# EAGLE schematic Pulsar v1 (EAGLE 5.11)

## Sheet 1 of 6
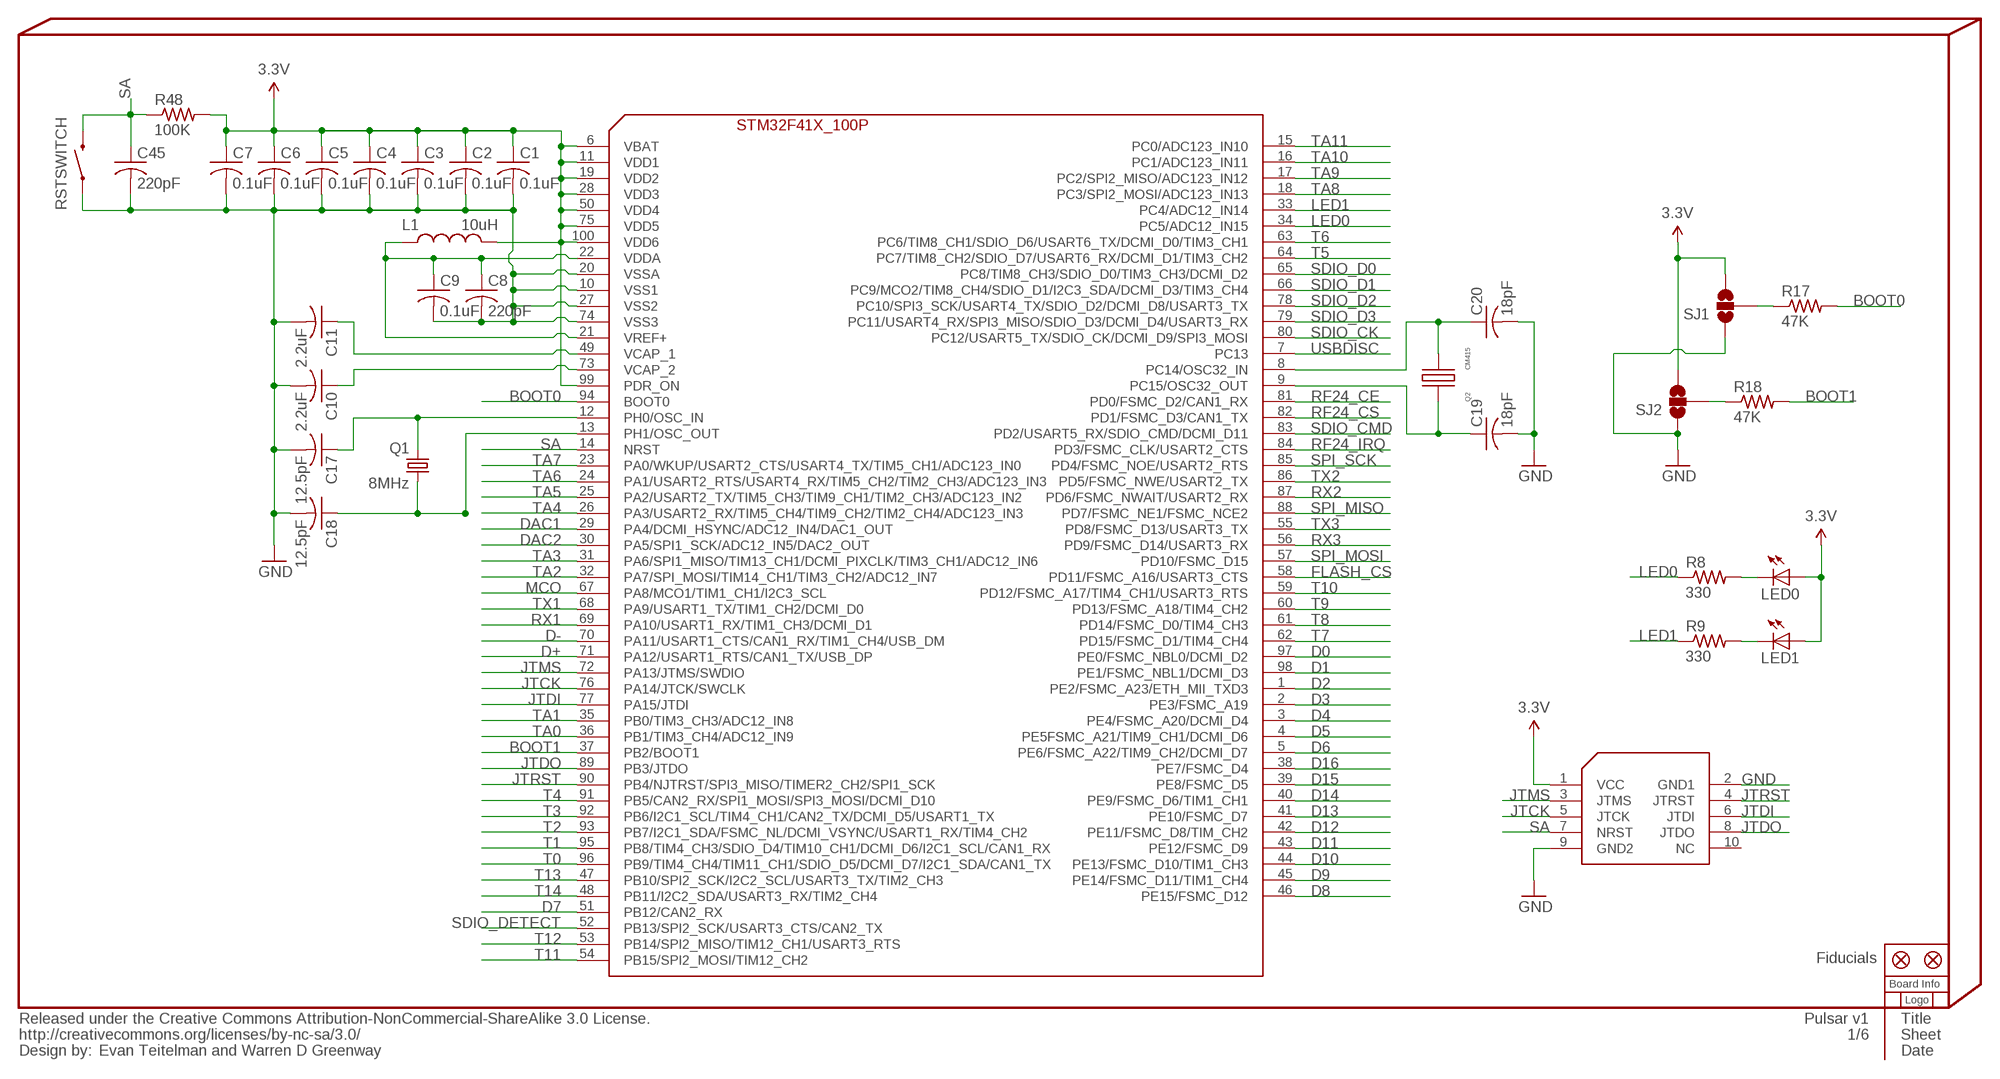
[diagram p0: schematic, sheet 1]

### Parts
C1  0.1uF  C-USC0402  [C0402]
C2  0.1uF  C-USC0402  [C0402]
C3  0.1uF  C-USC0402  [C0402]
C4  0.1uF  C-USC0402  [C0402]
C5  0.1uF  C-USC0402  [C0402]
C6  0.1uF  C-USC0402  [C0402]
C7  0.1uF  C-USC0402  [C0402]
C8  220pF  C-USC0402  [C0402]
C9  0.1uF  C-USC0402  [C0402]
C10  2.2uF  C-USC0402  [C0402]
C11  2.2uF  C-USC0402  [C0402]
C17  12.5pF  C-USC0402  [C0402]
C18  12.5pF  C-USC0402  [C0402]
C19  18pF  C-USC0402  [C0402]
C20  18pF  C-USC0402  [C0402]
C45  220pF  C-USC0402  [C0402]
INFO12  Evan Teitelman and Warren D Greenway  %CC-NC-SA  [%CC-NC-SA]
INFO13  %BRDINFOPULSAR  [%BOARDINFO-PULSAR]
JP1  FIDUCIAL1X2  [FIDUCIAL-1X2]
JP2  FIDUCIAL1X2  [FIDUCIAL-1X2]
L1  10uH  INDUCTOR0805  [0805]
LED0  LED0603  [LED-0603]
LED1  LED0603  [LED-0603]
LOGO1  Designed by Evan Teitelman and Warren D Greenway  #LOGOA+LONGTEXT  [#LOGOA+LONGTEXT]
Q1  8MHz  CRYSTAL5X3  [CRYSTAL-SMD-5X3]
Q2  CM415  [CM415]
R8  330  R-US_R0402  [R0402]
R9  330  R-US_R0402  [R0402]
R17  47K  R-US_R0402  [R0402]
R18  47K  R-US_R0402  [R0402]
R48  100K  R-US_R0402  [R0402]
RSTSWITCH  SWITCH-MOMENTARY-2SMD  [TACTILE_SWITCH_SMD]
SJ1  SOLDERJUMPER_2WAYS  [SJ_3]
SJ2  SOLDERJUMPER_2WAYS  [SJ_3]
U5  STM32-JTAG-10P  [STM32-JTAG-10P]
U$1  STM32F41X-100P  [TQFP100]

### Nets
3.3V: C1.1 C2.1 C3.1 C4.1 C5.1 C6.1 C7.1 L1.2 LED0.A LED1.A R48.2 SJ1.3 SJ2.3 U5.1(VCC) U$1.6(VBAT) U$1.11(VDD1) U$1.19(VDD2) U$1.28(VDD3) U$1.50(VDD4) U$1.75(VDD5) U$1.99(PDR_ON) U$1.100(VDD6) ; supply symbol labelled @3.3V ; also sheet 2,3,4,5
BOOT0: R17.2 U$1.94(BOOT0) ; also sheet 2
BOOT1: R18.2 U$1.37(PB2/BOOT1) ; also sheet 2
D0: U$1.97(PE0/FSMC_NBL0/DCMI_D2) ; also sheet 2
D1: U$1.98(PE1/FSMC_NBL1/DCMI_D3) ; also sheet 2
D2: U$1.1(PE2/FSMC_A23/ETH_MII_TXD3) ; also sheet 2
D3: U$1.2(PE3/FSMC_A19) ; also sheet 2
D4: U$1.3(PE4/FSMC_A20/DCMI_D4) ; also sheet 2
D5: U$1.4(PE5FSMC_A21/TIM9_CH1/DCMI_D6) ; also sheet 2
D6: U$1.5(PE6/FSMC_A22/TIM9_CH2/DCMI_D7) ; also sheet 2
D7: U$1.51(PB12/CAN2_RX) ; also sheet 2
D8: U$1.46(PE15/FSMC_D12) ; also sheet 2
D9: U$1.45(PE14/FSMC_D11/TIM1_CH4) ; also sheet 2
D10: U$1.44(PE13/FSMC_D10/TIM1_CH3) ; also sheet 2
D11: U$1.43(PE12/FSMC_D9) ; also sheet 2
D12: U$1.42(PE11/FSMC_D8/TIM_CH2) ; also sheet 2
D13: U$1.41(PE10/FSMC_D7) ; also sheet 2
D14: U$1.40(PE9/FSMC_D6/TIM1_CH1) ; also sheet 2
D15: U$1.39(PE8/FSMC_D5) ; also sheet 2
D16: U$1.38(PE7/FSMC_D4) ; also sheet 2
D+: U$1.71(PA12/USART1_RTS/CAN1_TX/USB_DP) ; also sheet 2,4
D-: U$1.70(PA11/USART1_CTS/CAN1_RX/TIM1_CH4/USB_DM) ; also sheet 2,4
DAC1: U$1.29(PA4/DCMI_HSYNC/ADC12_IN4/DAC1_OUT) ; also sheet 2
DAC2: U$1.30(PA5/SPI1_SCK/ADC12_IN5/DAC2_OUT) ; also sheet 2
FLASH_CS: U$1.58(PD11/FSMC_A16/USART3_CTS) ; also sheet 4
GND: C1.2 C2.2 C3.2 C4.2 C5.2 C6.2 C7.2 C8.2 C9.2 C10.2 C11.2 C17.2 C18.2 C19.2 C20.2 C45.2 RSTSWITCH.1 SJ1.1 SJ2.1 U5.2(GND1) U5.9(GND2) U$1.10(VSS1) U$1.20(VSSA) U$1.27(VSS2) U$1.74(VSS3) ; supply symbol labelled @GND ; also sheet 2,3,4,5
JTCK: U5.5(JTCK) U$1.76(PA14/JTCK/SWCLK) ; also sheet 2
JTDI: U5.6(JTDI) U$1.77(PA15/JTDI) ; also sheet 2
JTDO: U5.8(JTDO) U$1.89(PB3/JTDO) ; also sheet 2
JTMS: U5.3(JTMS) U$1.72(PA13/JTMS/SWDIO) ; also sheet 2
JTRST: U5.4(JTRST) U$1.90(PB4/NJTRST/SPI3_MISO/TIMER2_CH2/SPI1_SCK) ; also sheet 2
LED0: R8.1 U$1.34(PC5/ADC12_IN15)
LED1: R9.1 U$1.33(PC4/ADC12_IN14)
MCO: U$1.67(PA8/MCO1/TIM1_CH1/I2C3_SCL) ; also sheet 2
N$1: C17.1 Q1.1 U$1.12(PH0/OSC_IN)
N$2: C8.1 C9.1 L1.1 U$1.21(VREF+) U$1.22(VDDA)
N$3: C18.1 Q1.3 U$1.13(PH1/OSC_OUT)
N$6: C11.1 U$1.49(VCAP_1)
N$7: C10.1 U$1.73(VCAP_2)
N$8: C20.1 Q2.P$2(XOUT) U$1.8(PC14/OSC32_IN)
N$9: C19.1 Q2.P$1(XIN) U$1.9(PC15/OSC32_OUT)
N$10: LED0.C R8.2
N$12: LED1.C R9.2
N$30: R17.1 SJ1.2
N$31: R18.1 SJ2.2
RF24_CE: U$1.81(PD0/FSMC_D2/CAN1_RX) ; also sheet 3
RF24_CS: U$1.82(PD1/FSMC_D3/CAN1_TX) ; also sheet 3
RF24_IRQ: U$1.84(PD3/FSMC_CLK/USART2_CTS) ; also sheet 3
RX1: U$1.69(PA10/USART1_RX/TIM1_CH3/DCMI_D1) ; also sheet 2
RX2: U$1.87(PD6/FSMC_NWAIT/USART2_RX) ; also sheet 2
RX3: U$1.56(PD9/FSMC_D14/USART3_RX) ; also sheet 2
SA: C45.1 R48.1 RSTSWITCH.3 U5.7(NRST) U$1.14(NRST) ; also sheet 2
SDIO_CK: U$1.80(PC12/USART5_TX/SDIO_CK/DCMI_D9/SPI3_MOSI) ; also sheet 4
SDIO_CMD: U$1.83(PD2/USART5_RX/SDIO_CMD/DCMI_D11) ; also sheet 4
SDIO_D0: U$1.65(PC8/TIM8_CH3/SDIO_D0/TIM3_CH3/DCMI_D2) ; also sheet 4
SDIO_D1: U$1.66(PC9/MCO2/TIM8_CH4/SDIO_D1/I2C3_SDA/DCMI_D3/TIM3_CH4) ; also sheet 4
SDIO_D2: U$1.78(PC10/SPI3_SCK/USART4_TX/SDIO_D2/DCMI_D8/USART3_TX) ; also sheet 4
SDIO_D3: U$1.79(PC11/USART4_RX/SPI3_MISO/SDIO_D3/DCMI_D4/USART3_RX) ; also sheet 4
SDIO_DETECT: U$1.52(PB13/SPI2_SCK/USART3_CTS/CAN2_TX) ; also sheet 4
SPI_MISO: U$1.88(PD7/FSMC_NE1/FSMC_NCE2) ; also sheet 3,4
SPI_MOSI: U$1.57(PD10/FSMC_D15) ; also sheet 3,4
SPI_SCK: U$1.85(PD4/FSMC_NOE/USART2_RTS) ; also sheet 3,4
T0: U$1.96(PB9/TIM4_CH4/TIM11_CH1/SDIO_D5/DCMI_D7/I2C1_SDA/CAN1_TX) ; also sheet 2
T1: U$1.95(PB8/TIM4_CH3/SDIO_D4/TIM10_CH1/DCMI_D6/I2C1_SCL/CAN1_RX) ; also sheet 2
T2: U$1.93(PB7/I2C1_SDA/FSMC_NL/DCMI_VSYNC/USART1_RX/TIM4_CH2) ; also sheet 2
T3: U$1.92(PB6/I2C1_SCL/TIM4_CH1/CAN2_TX/DCMI_D5/USART1_TX) ; also sheet 2
T4: U$1.91(PB5/CAN2_RX/SPI1_MOSI/SPI3_MOSI/DCMI_D10) ; also sheet 2
T5: U$1.64(PC7/TIM8_CH2/SDIO_D7/USART6_RX/DCMI_D1/TIM3_CH2) ; also sheet 2
T6: U$1.63(PC6/TIM8_CH1/SDIO_D6/USART6_TX/DCMI_D0/TIM3_CH1) ; also sheet 2
T7: U$1.62(PD15/FSMC_D1/TIM4_CH4) ; also sheet 2
T8: U$1.61(PD14/FSMC_D0/TIM4_CH3) ; also sheet 2
T9: U$1.60(PD13/FSMC_A18/TIM4_CH2) ; also sheet 2
T10: U$1.59(PD12/FSMC_A17/TIM4_CH1/USART3_RTS) ; also sheet 2
T11: U$1.54(PB15/SPI2_MOSI/TIM12_CH2) ; also sheet 2
T12: U$1.53(PB14/SPI2_MISO/TIM12_CH1/USART3_RTS) ; also sheet 2
T13: U$1.47(PB10/SPI2_SCK/I2C2_SCL/USART3_TX/TIM2_CH3) ; also sheet 2
T14: U$1.48(PB11/I2C2_SDA/USART3_RX/TIM2_CH4) ; also sheet 2
TA0: U$1.36(PB1/TIM3_CH4/ADC12_IN9) ; also sheet 2
TA1: U$1.35(PB0/TIM3_CH3/ADC12_IN8) ; also sheet 2
TA2: U$1.32(PA7/SPI_MOSI/TIM14_CH1/TIM3_CH2/ADC12_IN7) ; also sheet 2
TA3: U$1.31(PA6/SPI1_MISO/TIM13_CH1/DCMI_PIXCLK/TIM3_CH1/ADC12_IN6) ; also sheet 2
TA4: U$1.26(PA3/USART2_RX/TIM5_CH4/TIM9_CH2/TIM2_CH4/ADC123_IN3) ; also sheet 2
TA5: U$1.25(PA2/USART2_TX/TIM5_CH3/TIM9_CH1/TIM2_CH3/ADC123_IN2) ; also sheet 2
TA6: U$1.24(PA1/USART2_RTS/USART4_RX/TIM5_CH2/TIM2_CH3/ADC123_IN3) ; also sheet 2
TA7: U$1.23(PA0/WKUP/USART2_CTS/USART4_TX/TIM5_CH1/ADC123_IN0) ; also sheet 2
TA8: U$1.18(PC3/SPI2_MOSI/ADC123_IN13) ; also sheet 2
TA9: U$1.17(PC2/SPI2_MISO/ADC123_IN12) ; also sheet 2
TA10: U$1.16(PC1/ADC123_IN11) ; also sheet 2
TA11: U$1.15(PC0/ADC123_IN10) ; also sheet 2
TX1: U$1.68(PA9/USART1_TX/TIM1_CH2/DCMI_D0) ; also sheet 2
TX2: U$1.86(PD5/FSMC_NWE/USART2_TX) ; also sheet 2
TX3: U$1.55(PD8/FSMC_D13/USART3_TX) ; also sheet 2
USBDISC: U$1.7(PC13) ; also sheet 2,4
Unconnected: U5.10(NC)

### Notes on the sheet
- Fiducials

## Sheet 2 of 6
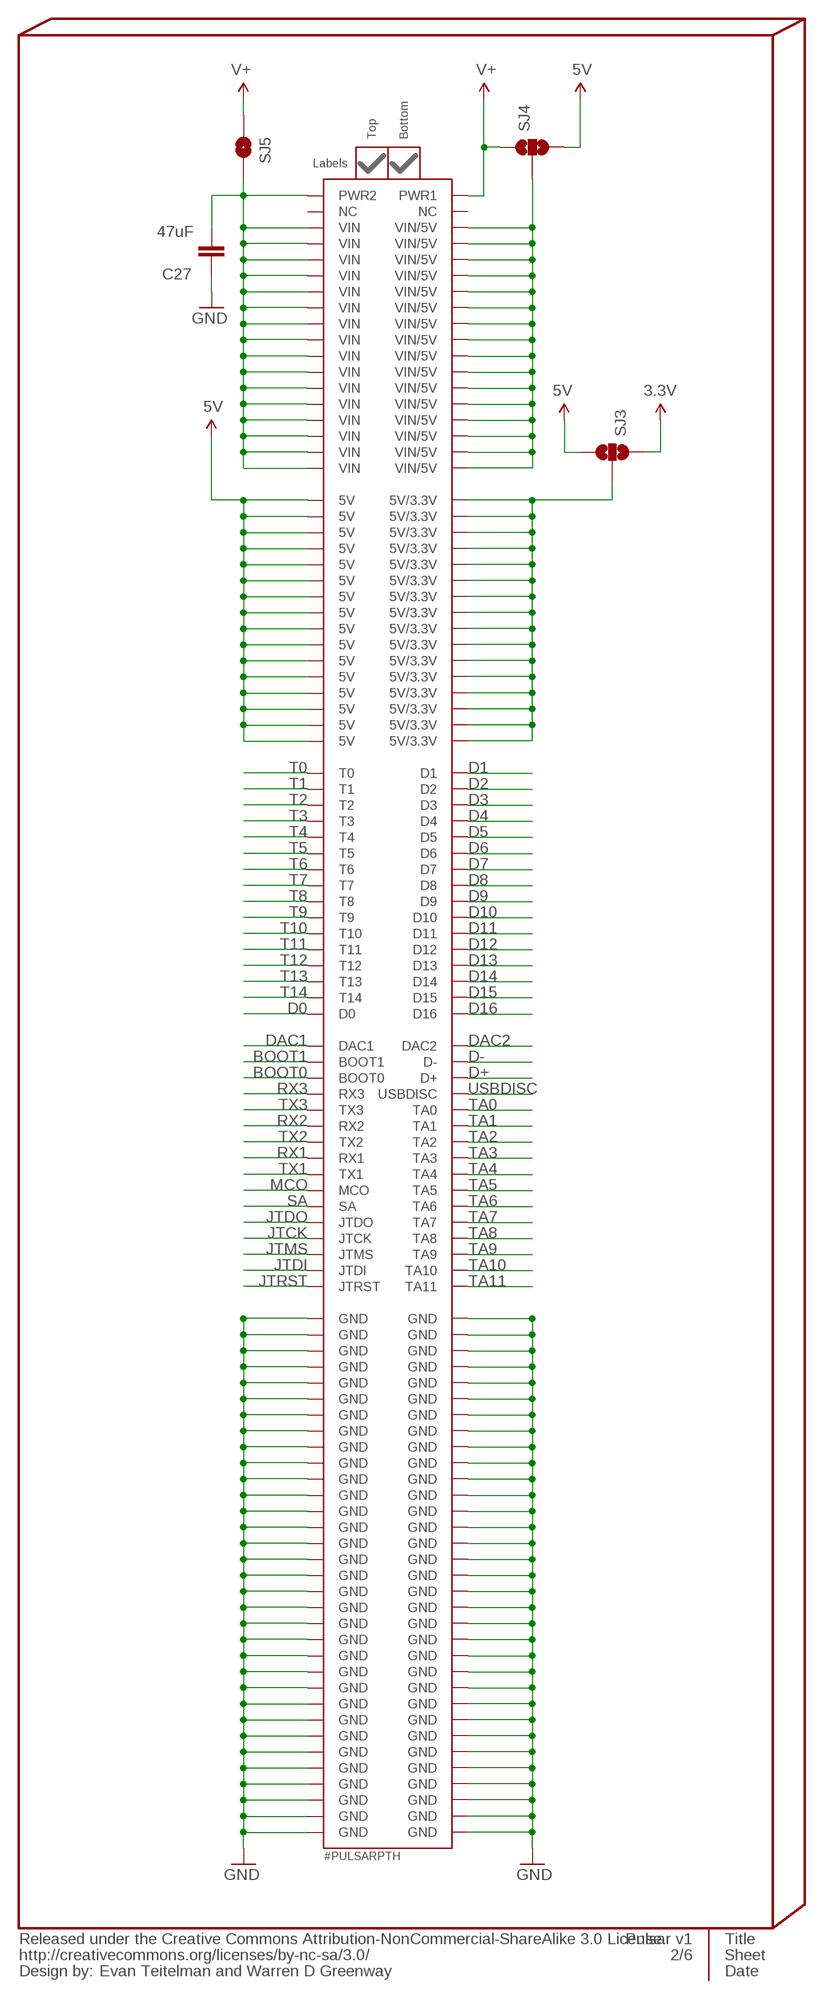
[diagram p1: schematic, sheet 2]

### Parts
C27  47uF  CAP1206  [1206]
FP1  #PULSARPTH  [#PULSAR-PTH]
PULSARPART1  #PULSAR-PARTLABELS-BOTTOM  [#PULSAR-LABELS-BOTT]
SJ3  SOLDERJUMPER_2WAYPASTE1&2  [SJ_3_PASTE1&2]
SJ4  SOLDERJUMPER_2WAYPASTE1&2  [SJ_3_PASTE1&2]
SJ5  SOLDERJUMPERNO  [SJ_2S-NO]

### Nets
3.3V: SJ3.1 ; supply symbol labelled @3.3V ; also sheet 1,3,4,5
5V: FP1.5V1(5V) FP1.5V2(5V) FP1.5V3(5V) FP1.5V4(5V) FP1.5V5(5V) FP1.5V6(5V) FP1.5V7(5V) FP1.5V8(5V) FP1.5V9(5V) FP1.5V10(5V) FP1.5V11(5V) FP1.5V12(5V) FP1.5V13(5V) FP1.5V14(5V) FP1.5V15(5V) FP1.5V16(5V) SJ3.3 SJ4.3 ; supply symbol labelled @5V ; also sheet 5
5V/3.3V: FP1.5V/3.3V1(5V/3.3V) FP1.5V/3.3V2(5V/3.3V) FP1.5V/3.3V3(5V/3.3V) FP1.5V/3.3V4(5V/3.3V) FP1.5V/3.3V5(5V/3.3V) FP1.5V/3.3V6(5V/3.3V) FP1.5V/3.3V7(5V/3.3V) FP1.5V/3.3V8(5V/3.3V) FP1.5V/3.3V9(5V/3.3V) FP1.5V/3.3V10(5V/3.3V) FP1.5V/3.3V11(5V/3.3V) FP1.5V/3.3V12(5V/3.3V) FP1.5V/3.3V13(5V/3.3V) FP1.5V/3.3V14(5V/3.3V) FP1.5V/3.3V15(5V/3.3V) FP1.5V/3.3V16(5V/3.3V) SJ3.2
BOOT0: FP1.BOOT0 ; also sheet 1
BOOT1: FP1.BOOT1 ; also sheet 1
D0: FP1.D0 ; also sheet 1
D1: FP1.D1 ; also sheet 1
D2: FP1.D2 ; also sheet 1
D3: FP1.D3 ; also sheet 1
D4: FP1.D4 ; also sheet 1
D5: FP1.D5 ; also sheet 1
D6: FP1.D6 ; also sheet 1
D7: FP1.D7 ; also sheet 1
D8: FP1.D8 ; also sheet 1
D9: FP1.D9 ; also sheet 1
D10: FP1.D10 ; also sheet 1
D11: FP1.D11 ; also sheet 1
D12: FP1.D12 ; also sheet 1
D13: FP1.D13 ; also sheet 1
D14: FP1.D14 ; also sheet 1
D15: FP1.D15 ; also sheet 1
D16: FP1.D16 ; also sheet 1
D+: FP1.D+ ; also sheet 1,4
D-: FP1.D- ; also sheet 1,4
DAC1: FP1.DAC1 ; also sheet 1
DAC2: FP1.DAC2 ; also sheet 1
GND: C27.2 FP1.GND1(GND) FP1.GND2(GND) FP1.GND3(GND) FP1.GND4(GND) FP1.GND5(GND) FP1.GND6(GND) FP1.GND7(GND) FP1.GND8(GND) FP1.GND9(GND) FP1.GND10(GND) FP1.GND11(GND) FP1.GND12(GND) FP1.GND13(GND) FP1.GND14(GND) FP1.GND15(GND) FP1.GND16(GND) FP1.GND17(GND) FP1.GND18(GND) FP1.GND19(GND) FP1.GND20(GND) FP1.GND21(GND) FP1.GND22(GND) FP1.GND23(GND) FP1.GND24(GND) FP1.GND25(GND) FP1.GND26(GND) FP1.GND27(GND) FP1.GND28(GND) FP1.GND29(GND) FP1.GND30(GND) FP1.GND31(GND) FP1.GND32(GND) FP1.GND33(GND) FP1.GND34(GND) FP1.GND35(GND) FP1.GND36(GND) FP1.GND37(GND) FP1.GND38(GND) FP1.GND39(GND) FP1.GND40(GND) FP1.GND41(GND) FP1.GND42(GND) FP1.GND43(GND) FP1.GND44(GND) FP1.GND45(GND) FP1.GND46(GND) FP1.GND47(GND) FP1.GND48(GND) FP1.GND49(GND) FP1.GND50(GND) FP1.GND51(GND) FP1.GND52(GND) FP1.GND53(GND) FP1.GND54(GND) FP1.GND55(GND) FP1.GND56(GND) FP1.GND57(GND) FP1.GND58(GND) FP1.GND59(GND) FP1.GND60(GND) FP1.GND61(GND) FP1.GND62(GND) FP1.GND63(GND) FP1.GND64(GND) FP1.GND65(GND) FP1.GND66(GND) ; supply symbol labelled @GND ; also sheet 1,3,4,5
JTCK: FP1.JTCK ; also sheet 1
JTDI: FP1.JTDI ; also sheet 1
JTDO: FP1.JTDO ; also sheet 1
JTMS: FP1.JTMS ; also sheet 1
JTRST: FP1.JTRST ; also sheet 1
MCO: FP1.MCO ; also sheet 1
RX1: FP1.RX1 ; also sheet 1
RX2: FP1.RX2 ; also sheet 1
RX3: FP1.RX3 ; also sheet 1
SA: FP1.SA ; also sheet 1
T0: FP1.T0 ; also sheet 1
T1: FP1.T1 ; also sheet 1
T2: FP1.T2 ; also sheet 1
T3: FP1.T3 ; also sheet 1
T4: FP1.T4 ; also sheet 1
T5: FP1.T5 ; also sheet 1
T6: FP1.T6 ; also sheet 1
T7: FP1.T7 ; also sheet 1
T8: FP1.T8 ; also sheet 1
T9: FP1.T9 ; also sheet 1
T10: FP1.T10 ; also sheet 1
T11: FP1.T11 ; also sheet 1
T12: FP1.T12 ; also sheet 1
T13: FP1.T13 ; also sheet 1
T14: FP1.T14 ; also sheet 1
TA0: FP1.TA0 ; also sheet 1
TA1: FP1.TA1 ; also sheet 1
TA2: FP1.TA2 ; also sheet 1
TA3: FP1.TA3 ; also sheet 1
TA4: FP1.TA4 ; also sheet 1
TA5: FP1.TA5 ; also sheet 1
TA6: FP1.TA6 ; also sheet 1
TA7: FP1.TA7 ; also sheet 1
TA8: FP1.TA8 ; also sheet 1
TA9: FP1.TA9 ; also sheet 1
TA10: FP1.TA10 ; also sheet 1
TA11: FP1.TA11 ; also sheet 1
TX1: FP1.TX1 ; also sheet 1
TX2: FP1.TX2 ; also sheet 1
TX3: FP1.TX3 ; also sheet 1
USBDISC: FP1.USBDISC ; also sheet 1,4
V+: FP1.PWR1 SJ4.1 SJ5.2 ; supply symbol labelled @V+ ; also sheet 5
VIN: C27.1 FP1.PWR2 FP1.VIN1(VIN) FP1.VIN2(VIN) FP1.VIN3(VIN) FP1.VIN4(VIN) FP1.VIN5(VIN) FP1.VIN6(VIN) FP1.VIN7(VIN) FP1.VIN8(VIN) FP1.VIN9(VIN) FP1.VIN10(VIN) FP1.VIN11(VIN) FP1.VIN12(VIN) FP1.VIN13(VIN) FP1.VIN14(VIN) FP1.VIN15(VIN) FP1.VIN16(VIN) SJ5.1
VIN/5V: FP1.VIN/5V1(VIN/5V) FP1.VIN/5V2(VIN/5V) FP1.VIN/5V3(VIN/5V) FP1.VIN/5V4(VIN/5V) FP1.VIN/5V5(VIN/5V) FP1.VIN/5V6(VIN/5V) FP1.VIN/5V7(VIN/5V) FP1.VIN/5V8(VIN/5V) FP1.VIN/5V9(VIN/5V) FP1.VIN/5V10(VIN/5V) FP1.VIN/5V11(VIN/5V) FP1.VIN/5V12(VIN/5V) FP1.VIN/5V13(VIN/5V) FP1.VIN/5V14(VIN/5V) FP1.VIN/5V15(VIN/5V) FP1.VIN/5V16(VIN/5V) SJ4.2
Unconnected: FP1.NULL1(NC) FP1.NULL2(NC)

## Sheet 3 of 6
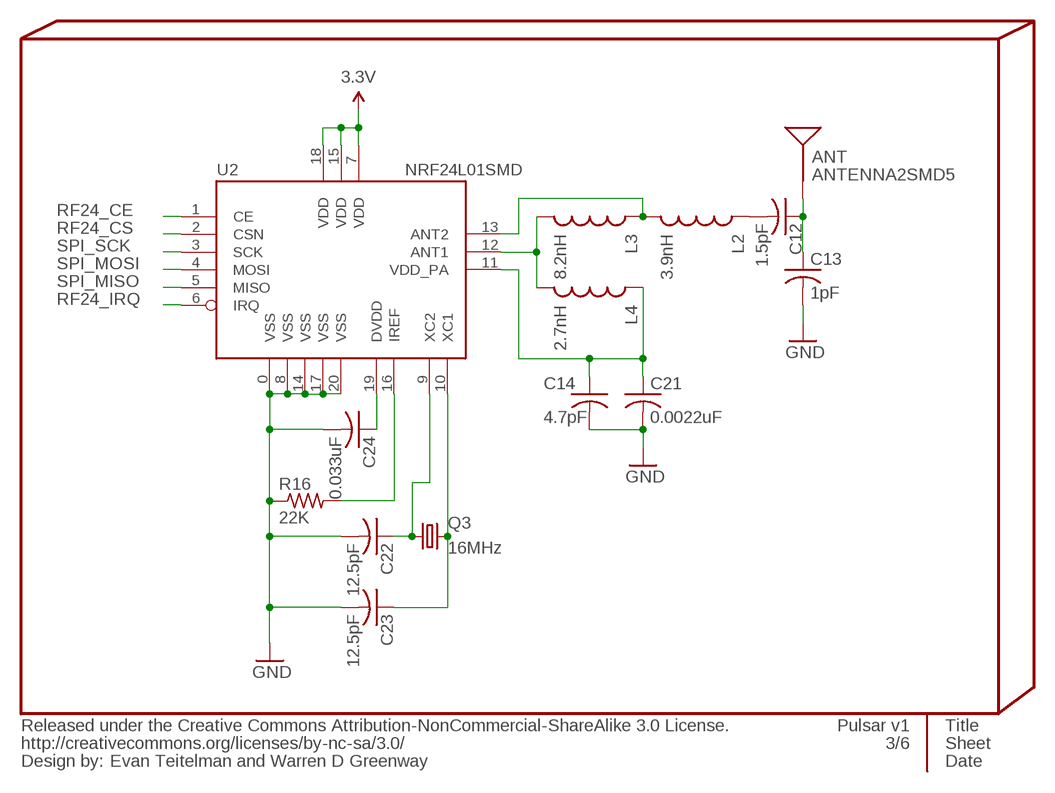
[diagram p2: schematic, sheet 3]

### Parts
ANT  ANTENNA2SMD5  [ANTENNA-CHIP5]
C12  1.5pF  C-USC0402  [C0402]
C13  1pF  C-USC0402  [C0402]
C14  4.7pF  C-USC0402  [C0402]
C21  0.0022uF  C-USC0402  [C0402]
C22  12.5pF  C-USC0402  [C0402]
C23  12.5pF  C-USC0402  [C0402]
C24  0.033uF  C-USC0402  [C0402]
L2  3.9nH  INDUCTOR0603  [0603]
L3  8.2nH  INDUCTOR0603  [0603]
L4  2.7nH  INDUCTOR0603  [0603]
Q3  16MHz  CRYSTAL5X3  [CRYSTAL-SMD-5X3]
R16  22K  R-US_R0402  [R0402]
U2  NRF24L01SMD  [QFN20]

### Nets
3.3V: U2.7(VDD) U2.15(VDD) U2.18(VDD) ; supply symbol labelled @3.3V ; also sheet 1,2,4,5
GND: C13.2 C14.2 C21.2 C22.2 C23.2 C24.2 R16.1 U2.0(VSS) U2.8(VSS) U2.14(VSS) U2.17(VSS) U2.20(VSS) ; supply symbol labelled @GND ; also sheet 1,2,4,5
N$17: C12.2 L2.1
N$18: L3.2 L4.2 U2.12(ANT1)
N$19: ANT.FEED(SIGNAL) C12.1 C13.1
N$20: L2.2 L3.1 U2.13(ANT2)
N$21: C14.1 C21.1 L4.1 U2.11(VDD_PA)
N$23: R16.2 U2.16(IREF)
N$24: C24.1 U2.19(DVDD)
N$26: C22.1 Q3.1 U2.9(XC2)
N$27: C23.1 Q3.3 U2.10(XC1)
RF24_CE: U2.1(CE) ; also sheet 1
RF24_CS: U2.2(CSN) ; also sheet 1
RF24_IRQ: U2.6(IRQ) ; also sheet 1
SPI_MISO: U2.5(MISO) ; also sheet 1,4
SPI_MOSI: U2.4(MOSI) ; also sheet 1,4
SPI_SCK: U2.3(SCK) ; also sheet 1,4

## Sheet 4 of 6
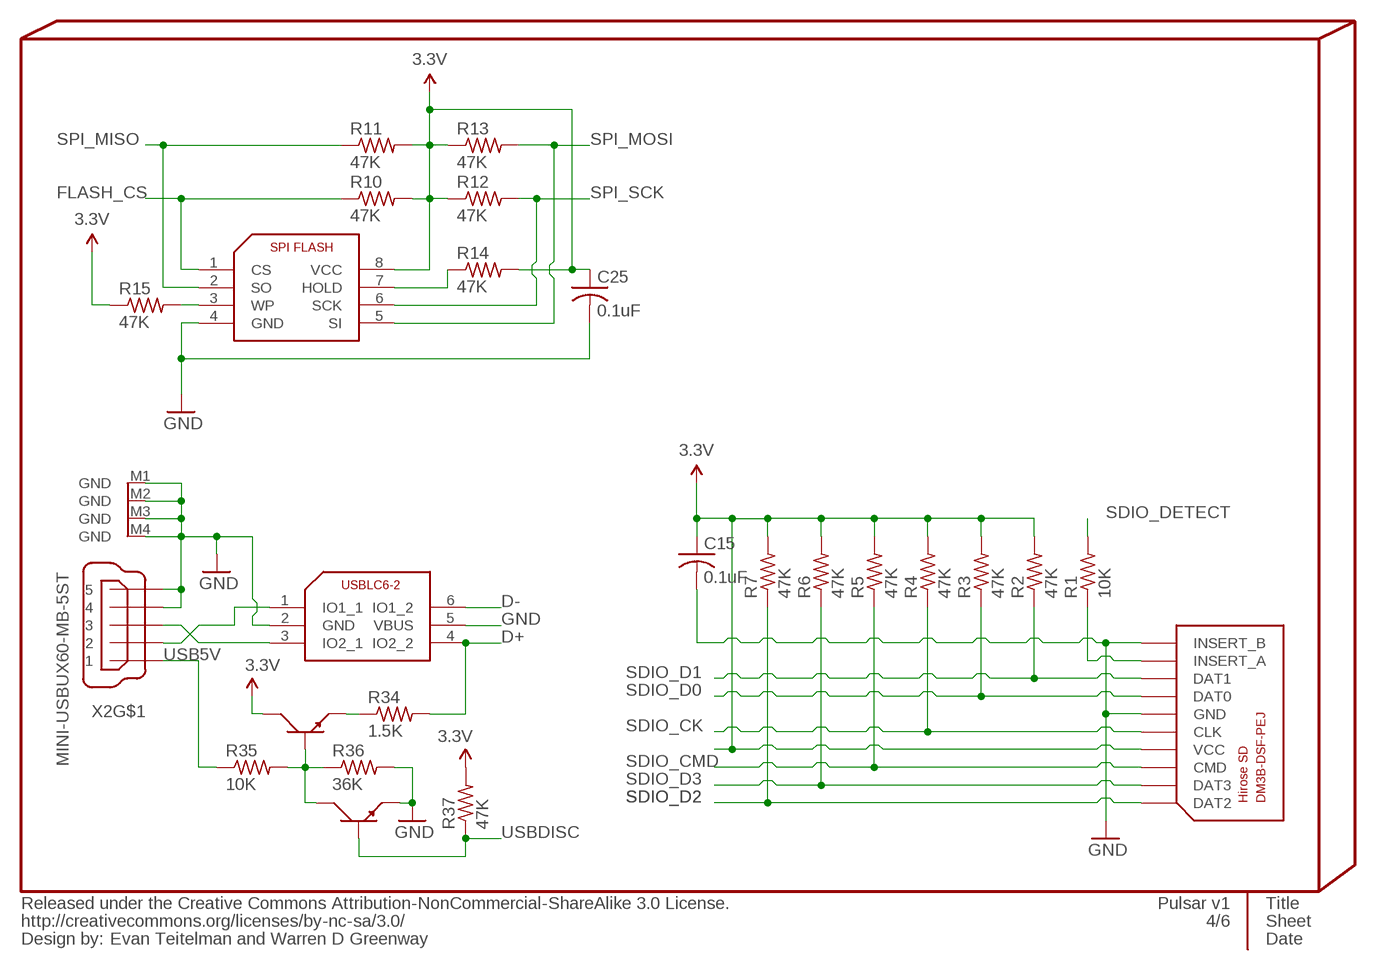
[diagram p3: schematic, sheet 4]

### Parts
C15  0.1uF  C-USC0402  [C0402]
C25  0.1uF  C-USC0402  [C0402]
R1  10K  R-US_R0402  [R0402]
R2  47K  R-US_R0402  [R0402]
R3  47K  R-US_R0402  [R0402]
R4  47K  R-US_R0402  [R0402]
R5  47K  R-US_R0402  [R0402]
R6  47K  R-US_R0402  [R0402]
R7  47K  R-US_R0402  [R0402]
R10  47K  R-US_R0402  [R0402]
R11  47K  R-US_R0402  [R0402]
R12  47K  R-US_R0402  [R0402]
R13  47K  R-US_R0402  [R0402]
R14  47K  R-US_R0402  [R0402]
R15  47K  R-US_R0402  [R0402]
R34  1.5K  R-US_R0402  [R0402]
R35  10K  R-US_R0402  [R0402]
R36  36K  R-US_R0402  [R0402]
R37  47K  R-US_R0402  [R0402]
U3  SST25VF080B  [DUBLIB_SOIC8]
U4  USBLC6-2  [SOT23-6L]
U6  HIROSE-SDCARD-DM3B-DSF-PEJ  [HIROSE-SDCARD-DM3B-DSF-PEJ]
U$23  PMBT6428  [SOT23]
U$24  PMBT6428  [SOT23]
X2  MINI-USBUX60-MB-5ST  [DUBLIB_UX60-MB-5ST]

### Nets
3.3V: C15.1 C25.1 R2.2 R3.2 R4.2 R5.2 R6.2 R7.2 R10.2 R11.2 R12.1 R13.1 R14.2 R15.1 R37.2 U3.8(VCC) U6.P$4(VCC) U$23.3 ; supply symbol labelled @3.3V ; also sheet 1,2,3,5
D+: R34.2 U4.4(IO2_2) ; also sheet 1,2
D-: U4.6(IO1_2) ; also sheet 1,2
FLASH_CS: R10.1 U3.1(CS) ; also sheet 1
GND: C15.2 C25.2 R36.2 U3.4(GND) U4.2(GND) U4.5(VBUS) U6.P$6(GND) U6.P$11(INSERT_B) U$24.2 X2.4 X2.5 X2.M1(GND) X2.M2(GND) X2.M3(GND) X2.M4(GND) ; supply symbol labelled @GND ; also sheet 1,2,3,5
N$4: R35.2 R36.1 U$23.1 U$24.3
N$11: R1.1 U6.P$9(INSERT_A)
N$25: R34.1 U$23.2
N$28: R15.2 U3.3(WP)
N$29: R14.1 U3.7(HOLD)
N$38: U4.1(IO1_1) X2.2
SDIO_CK: R4.1 U6.P$5(CLK) ; also sheet 1
SDIO_CMD: R5.1 U6.P$3(CMD) ; also sheet 1
SDIO_D0: R3.1 U6.P$7(DAT0) ; also sheet 1
SDIO_D1: R2.1 U6.P$8(DAT1) ; also sheet 1
SDIO_D2: R7.1 U6.P$1(DAT2) ; also sheet 1
SDIO_D3: R6.1 U6.P$2(DAT3) ; also sheet 1
SDIO_DETECT: R1.2 ; also sheet 1
SPI_MISO: R11.1 U3.2(SO) ; also sheet 1,3
SPI_MOSI: R13.2 U3.5(SI) ; also sheet 1,3
SPI_SCK: R12.2 U3.6(SCK) ; also sheet 1,3
USB5V: R35.1 X2.1
USBDISC: R37.1 U$24.1 ; also sheet 1,2
USBP3: U4.3(IO2_1) X2.3

## Sheet 5 of 6
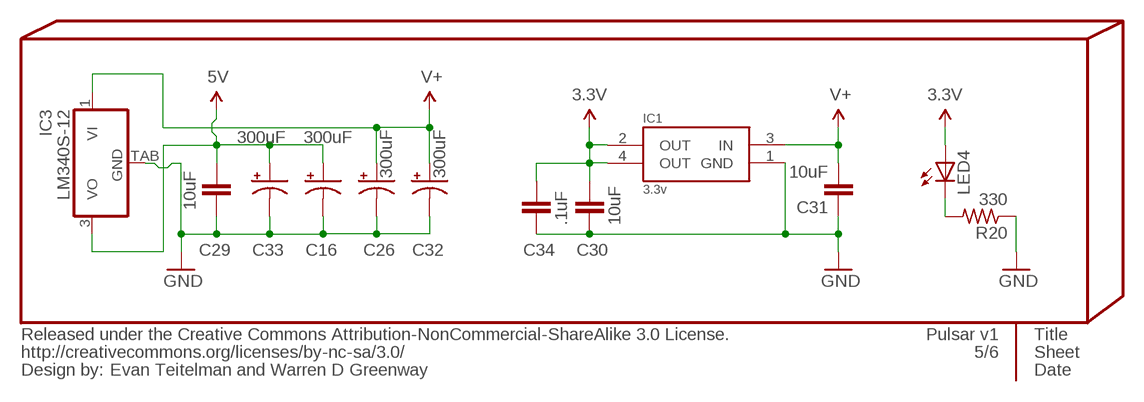
[diagram p4: schematic, sheet 5]

### Parts
C16  300uF  CAP_POLE  [PANASONIC_E]
C26  300uF  CAP_POLE  [PANASONIC_E]
C29  10uF  CAP1206  [1206]
C30  10uF  CAP1206  [1206]
C31  10uF  CAP1206  [1206]
C32  300uF  CAP_POLE  [PANASONIC_E]
C33  300uF  CAP_POLE  [PANASONIC_E]
C34  .1uF  CAP0402-CAP  [0402-CAP]
IC1  3.3v  TLV111  [SOT223]
IC3  LM340S-12  [TO263-3]
LED4  LED0603  [LED-0603]
R20  330  R-US_R0402  [R0402]

### Nets
3.3V: C30.1 C34.1 IC1.2(OUT) IC1.4(OUT) LED4.A ; supply symbol labelled @3.3V ; also sheet 1,2,3,4
5V: C16.+ C29.1 C33.+ IC3.3(VO) ; supply symbol labelled @5V ; also sheet 2
GND: C16.- C26.- C29.2 C30.2 C31.1 C32.- C33.- C34.2 IC1.1(GND) IC3.TAB(GND) R20.1 ; supply symbol labelled @GND ; also sheet 1,2,3,4
N$13: LED4.C R20.2
V+: C26.+ C31.2 C32.+ IC1.3(IN) IC3.1(VI) ; supply symbol labelled @V+ ; also sheet 2

## Sheet 6 of 6
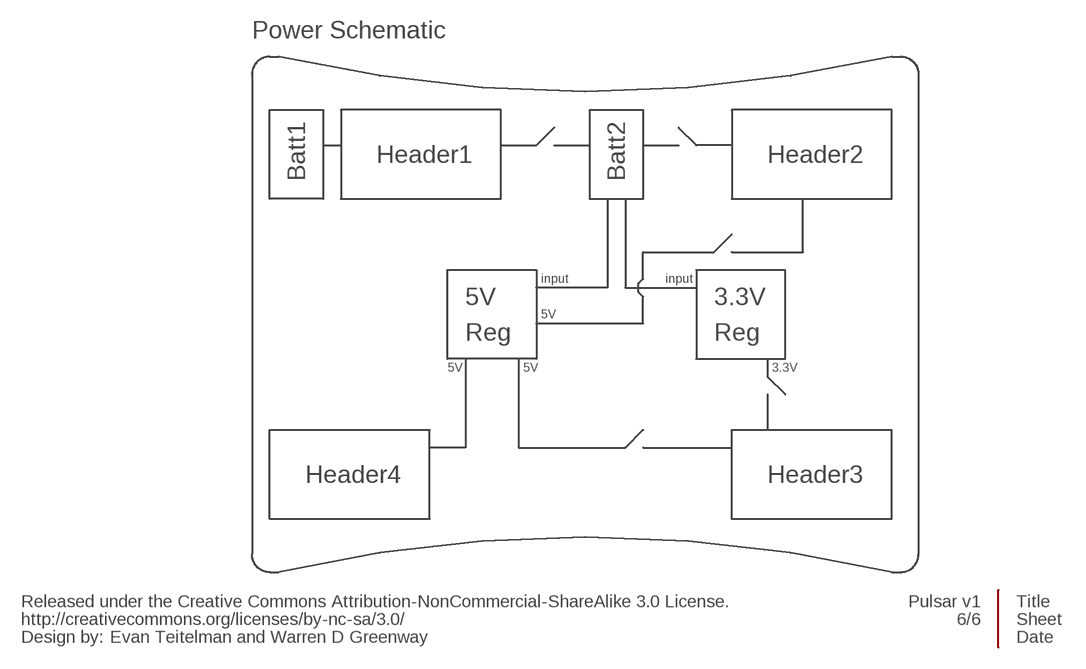
[diagram p5: schematic, sheet 6]

### Notes on the sheet
- Power Schematic
- Header1 | Header2
- Batt1 | Batt2
- input | input
- 5V | 3.3V
- 5V
- Reg | Reg
- 5V | 5V | 3.3V
- Header4 | Header3

## Power pins joined to a net without a drawn wire
GND: U6.P$12(GND) U6.P$13(GND) U6.P$14(GND)

## Library data of the parts
ANT = Pygmy:ANTENNA2: Antenna Single endded antenna. Common with smaller chip antennas. CHIP4 package is the GPS Chip Antenna SKU: GPS-08418. CHIP5 package is 2.4GHz chip antenna SKU: WRL-00144.
C1-C15 C17-C25 C45 = rcl:C-US: CAPACITOR, American symbol
C16 C26 C32 C33 = SparkFun:CAP_POL: Capacitor Polarized These are standard SMD and PTH capacitors. Normally 10uF, 47uF, and 100uF in electrolytic and tantalum varieties. Always verify the external diameter of the through hole cap, it varies with capacity, voltage, and manufacturer. The EIA devices should be standard.
C27 C29-C31 C34 = SparkFun:CAP: Capacitor Standard 0603 ceramic capacitor, and 0.1" leaded capacitor.
FP1 = PygmyBoards:#PULSAR: Pulsar Board and Shield Footprint Pads This is the only absolutely required part for the footprint. The parts in "#PULSAR-PART" are merely aesthetic. Reference board outline provided on the Document (48) layer.
IC1 = Custom12:TLV111
IC3 = linear:LM340?-*: Positive VOLTAGE REGULATOR Source: http://cache.national.com/ds/LM/LM340.pdf
INFO12 = PygmyBoards:%CC-NC-SA: Released under the Creative Commons Attribution-NonCommercial-ShareAlike 3.0 License. http://creativecommons.org/licenses/by-sa/3.0 Design by: [Designer Name] Change this part's value to change the designer name
INFO13 = PygmyBoards:%BRDINFO
JP1 JP2 = SparkFun:FIDUCIAL: Fiducial Alignment Points Various fiducial points for machine vision alignment.
L1 = SparkFun:INDUCTOR: Inductors Basic Inductor/Choke - 0603 and 1206. Footprints are not proven and vary greatly between part numbers.
L2-L4 = Pygmy:INDUCTOR: Inductors Basic Inductor/Choke - 0603 and 1206. Footprints are not proven and vary greatly between part numbers.
LED0 LED1 LED4 = Pygmy:LED: LEDs Standard schematic elements and footprints for 5mm, 3mm, 1206, and 0603 sized LEDs. 5mm - Spark Fun Electronics SKU : COM-00529 (and others)
LOGO1 = PygmyBoards:#LOGO: Various Pygmy logos
PULSARPART1 = PygmyBoards:#PULSAR-PART: Pulsar Board and Shield Footprint Parts These parts are only functional when combined with the pads in "#PULSAR".
Q1 Q3 = Pygmy:CRYSTAL: Crystals Various standard crystals. Proven footprints. Spark Fun Electronics SKU : COM-00534
Q2 = Pygmy:CM415
R1-R18 R20 R34-R37 R48 = rcl:R-US_: RESISTOR, American symbol
RSTSWITCH = SparkFun:SWITCH-MOMENTARY-2
SJ1-SJ4 = Pygmy:SOLDERJUMPER_2WAY: Solder Jumper 2 way solder jumper
SJ5 = Pygmy:SOLDERJUMPER: Solder Jumper Standard SMD solder jumper. Used to automate production. Two varients : Normally Open and Normally Closed are the same, but have different paste layers. NC will have a large amount of paste and should jumper during reflow.
U2 = Pygmy:NRF24L01: 2.4GHz Low Power Transceiver This is the very popular, low cost, very low power RF transceiver from Nordic Semiconductor. Simple SPI interface. SKU: COM-00690
U3 = Pygmy:SST25VF080B
U4 = Pygmy:USBLC6-2
U5 = Pygmy:STM32-JTAG-10P
U6 = Pygmy:HIROSE-SDCARD-DM3B-DSF-PEJ
U$1 = Pygmy:STM32F41X-100P
U$23 U$24 = dublib:PMBT6428
X2 = Pygmy:MINI-USB: MINI USB Connector Source: http://www.hirose.co.jp/cataloge_hp/e24000019.pdf